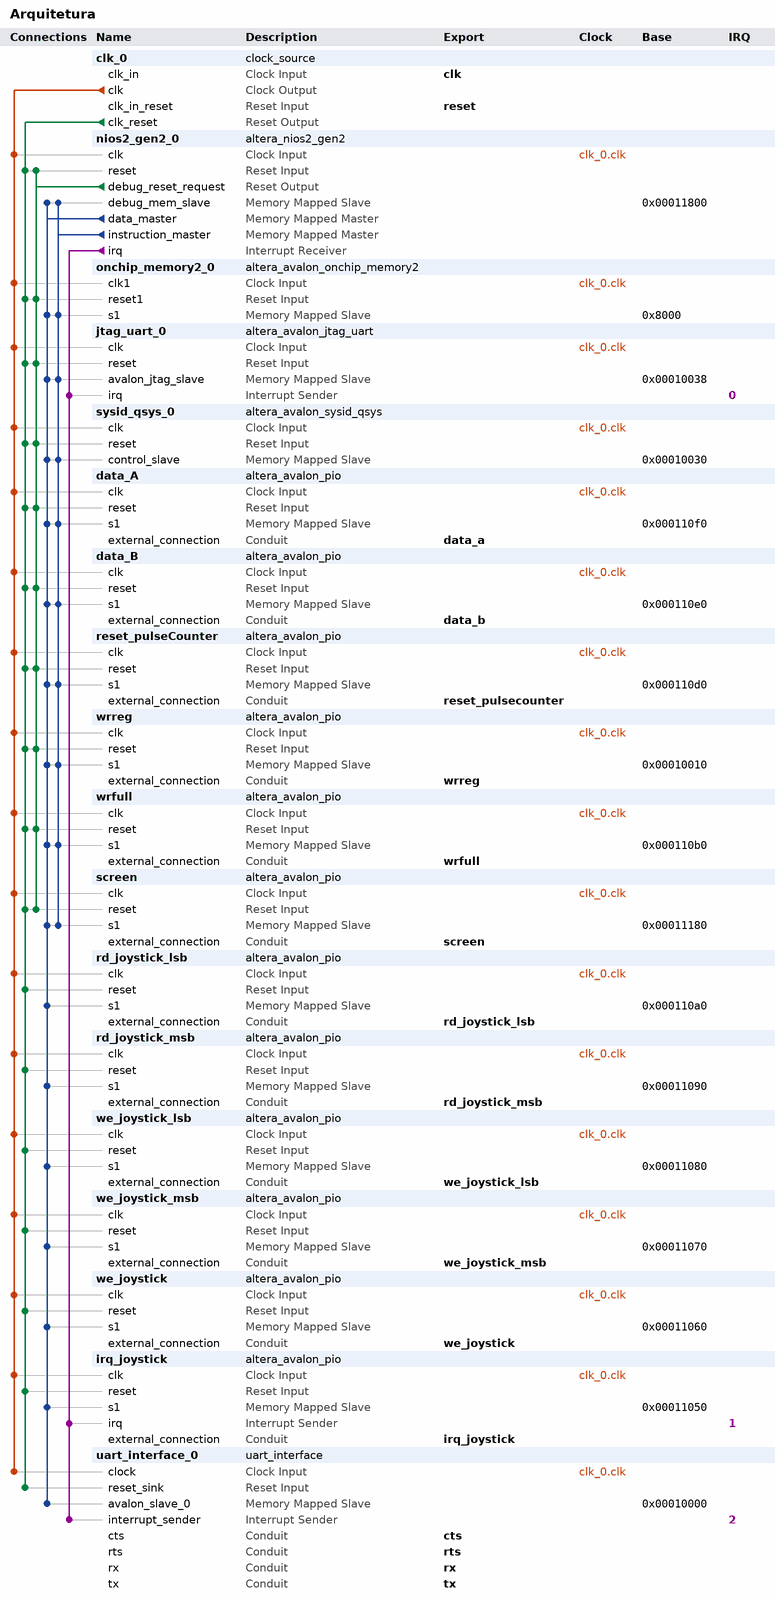
[diagram p0: system contents]
# Platform Designer (Qsys) system Arquitetura, Cyclone IV E EP4CE22F17C6
# Parameters at their usual value, and those the tool derives, are not listed.
package require -exact qsys 23.1
create_system Arquitetura
set_project_property DEVICE_FAMILY {Cyclone IV E}
set_project_property DEVICE EP4CE22F17C6

add_instance clk_0 clock_source 23.1
set_instance_parameter_value clk_0 clockFrequency 50000000

add_instance nios2_gen2_0 altera_nios2_gen2 23.1
set_instance_parameter_value nios2_gen2_0 dcache_size 2048
set_instance_parameter_value nios2_gen2_0 exceptionSlave onchip_memory2_0.s1
set_instance_parameter_value nios2_gen2_0 icache_size 4096
set_instance_parameter_value nios2_gen2_0 impl Tiny
set_instance_parameter_value nios2_gen2_0 resetSlave onchip_memory2_0.s1

add_instance onchip_memory2_0 altera_avalon_onchip_memory2 23.1
set_instance_parameter_value onchip_memory2_0 dataWidth 32
set_instance_parameter_value onchip_memory2_0 dualPort false
set_instance_parameter_value onchip_memory2_0 initMemContent true
set_instance_parameter_value onchip_memory2_0 initializationFileName onchip_mem.hex
set_instance_parameter_value onchip_memory2_0 memorySize 30000

add_instance jtag_uart_0 altera_avalon_jtag_uart 23.1
set_instance_parameter_value jtag_uart_0 simInteractiveOptions NO_INTERACTIVE_WINDOWS

add_instance sysid_qsys_0 altera_avalon_sysid_qsys 23.1
set_instance_parameter_value sysid_qsys_0 id 0

add_instance data_A altera_avalon_pio 23.1
set_instance_parameter_value data_A direction Output
set_instance_parameter_value data_A width 32

add_instance data_B altera_avalon_pio 23.1
set_instance_parameter_value data_B direction Output
set_instance_parameter_value data_B width 32

add_instance reset_pulseCounter altera_avalon_pio 23.1
set_instance_parameter_value reset_pulseCounter direction Output
set_instance_parameter_value reset_pulseCounter width 1

add_instance wrreg altera_avalon_pio 23.1
set_instance_parameter_value wrreg direction Output
set_instance_parameter_value wrreg width 1

add_instance wrfull altera_avalon_pio 23.1
set_instance_parameter_value wrfull direction Input
set_instance_parameter_value wrfull width 1

add_instance screen altera_avalon_pio 23.1
set_instance_parameter_value screen direction Input
set_instance_parameter_value screen width 1

add_instance rd_joystick_lsb altera_avalon_pio 23.1
set_instance_parameter_value rd_joystick_lsb direction Input
set_instance_parameter_value rd_joystick_lsb width 32

add_instance rd_joystick_msb altera_avalon_pio 23.1
set_instance_parameter_value rd_joystick_msb direction Input
set_instance_parameter_value rd_joystick_msb width 32

add_instance we_joystick_lsb altera_avalon_pio 23.1
set_instance_parameter_value we_joystick_lsb direction Output
set_instance_parameter_value we_joystick_lsb width 32

add_instance we_joystick_msb altera_avalon_pio 23.1
set_instance_parameter_value we_joystick_msb direction Output
set_instance_parameter_value we_joystick_msb width 32

add_instance we_joystick altera_avalon_pio 23.1
set_instance_parameter_value we_joystick direction Output
set_instance_parameter_value we_joystick width 1

add_instance irq_joystick altera_avalon_pio 23.1
set_instance_parameter_value irq_joystick direction Input
set_instance_parameter_value irq_joystick generateIRQ true
set_instance_parameter_value irq_joystick width 8

add_instance uart_interface_0 uart_interface 1.0

# connections
add_connection clk_0.clk data_A.clk clock
add_connection clk_0.clk data_B.clk clock
add_connection clk_0.clk irq_joystick.clk clock
add_connection clk_0.clk jtag_uart_0.clk clock
add_connection clk_0.clk nios2_gen2_0.clk clock
add_connection clk_0.clk onchip_memory2_0.clk1 clock
add_connection clk_0.clk rd_joystick_lsb.clk clock
add_connection clk_0.clk rd_joystick_msb.clk clock
add_connection clk_0.clk reset_pulseCounter.clk clock
add_connection clk_0.clk screen.clk clock
add_connection clk_0.clk sysid_qsys_0.clk clock
add_connection clk_0.clk uart_interface_0.clock clock
add_connection clk_0.clk we_joystick.clk clock
add_connection clk_0.clk we_joystick_lsb.clk clock
add_connection clk_0.clk we_joystick_msb.clk clock
add_connection clk_0.clk wrfull.clk clock
add_connection clk_0.clk wrreg.clk clock
add_connection clk_0.clk_reset data_A.reset reset
add_connection clk_0.clk_reset data_B.reset reset
add_connection clk_0.clk_reset irq_joystick.reset reset
add_connection clk_0.clk_reset jtag_uart_0.reset reset
add_connection clk_0.clk_reset nios2_gen2_0.reset reset
add_connection clk_0.clk_reset onchip_memory2_0.reset1 reset
add_connection clk_0.clk_reset rd_joystick_lsb.reset reset
add_connection clk_0.clk_reset rd_joystick_msb.reset reset
add_connection clk_0.clk_reset reset_pulseCounter.reset reset
add_connection clk_0.clk_reset screen.reset reset
add_connection clk_0.clk_reset sysid_qsys_0.reset reset
add_connection clk_0.clk_reset uart_interface_0.reset_sink reset
add_connection clk_0.clk_reset we_joystick.reset reset
add_connection clk_0.clk_reset we_joystick_lsb.reset reset
add_connection clk_0.clk_reset we_joystick_msb.reset reset
add_connection clk_0.clk_reset wrfull.reset reset
add_connection clk_0.clk_reset wrreg.reset reset
add_connection nios2_gen2_0.debug_reset_request data_A.reset reset
add_connection nios2_gen2_0.debug_reset_request data_B.reset reset
add_connection nios2_gen2_0.debug_reset_request jtag_uart_0.reset reset
add_connection nios2_gen2_0.debug_reset_request nios2_gen2_0.reset reset
add_connection nios2_gen2_0.debug_reset_request onchip_memory2_0.reset1 reset
add_connection nios2_gen2_0.debug_reset_request reset_pulseCounter.reset reset
add_connection nios2_gen2_0.debug_reset_request screen.reset reset
add_connection nios2_gen2_0.debug_reset_request sysid_qsys_0.reset reset
add_connection nios2_gen2_0.debug_reset_request wrfull.reset reset
add_connection nios2_gen2_0.debug_reset_request wrreg.reset reset
add_connection nios2_gen2_0.data_master data_A.s1 avalon
set_connection_parameter_value nios2_gen2_0.data_master/data_A.s1 baseAddress 0x000110f0
add_connection nios2_gen2_0.data_master data_B.s1 avalon
set_connection_parameter_value nios2_gen2_0.data_master/data_B.s1 baseAddress 0x000110e0
add_connection nios2_gen2_0.data_master irq_joystick.s1 avalon
set_connection_parameter_value nios2_gen2_0.data_master/irq_joystick.s1 baseAddress 0x00011050
add_connection nios2_gen2_0.data_master jtag_uart_0.avalon_jtag_slave avalon
set_connection_parameter_value nios2_gen2_0.data_master/jtag_uart_0.avalon_jtag_slave baseAddress 0x00010038
add_connection nios2_gen2_0.data_master nios2_gen2_0.debug_mem_slave avalon
set_connection_parameter_value nios2_gen2_0.data_master/nios2_gen2_0.debug_mem_slave baseAddress 0x00011800
add_connection nios2_gen2_0.data_master onchip_memory2_0.s1 avalon
set_connection_parameter_value nios2_gen2_0.data_master/onchip_memory2_0.s1 baseAddress 0x8000
add_connection nios2_gen2_0.data_master rd_joystick_lsb.s1 avalon
set_connection_parameter_value nios2_gen2_0.data_master/rd_joystick_lsb.s1 baseAddress 0x000110a0
add_connection nios2_gen2_0.data_master rd_joystick_msb.s1 avalon
set_connection_parameter_value nios2_gen2_0.data_master/rd_joystick_msb.s1 baseAddress 0x00011090
add_connection nios2_gen2_0.data_master reset_pulseCounter.s1 avalon
set_connection_parameter_value nios2_gen2_0.data_master/reset_pulseCounter.s1 baseAddress 0x000110d0
add_connection nios2_gen2_0.data_master screen.s1 avalon
set_connection_parameter_value nios2_gen2_0.data_master/screen.s1 baseAddress 0x00011180
add_connection nios2_gen2_0.data_master sysid_qsys_0.control_slave avalon
set_connection_parameter_value nios2_gen2_0.data_master/sysid_qsys_0.control_slave baseAddress 0x00010030
add_connection nios2_gen2_0.data_master uart_interface_0.avalon_slave_0 avalon
set_connection_parameter_value nios2_gen2_0.data_master/uart_interface_0.avalon_slave_0 baseAddress 0x00010000
add_connection nios2_gen2_0.data_master we_joystick.s1 avalon
set_connection_parameter_value nios2_gen2_0.data_master/we_joystick.s1 baseAddress 0x00011060
add_connection nios2_gen2_0.data_master we_joystick_lsb.s1 avalon
set_connection_parameter_value nios2_gen2_0.data_master/we_joystick_lsb.s1 baseAddress 0x00011080
add_connection nios2_gen2_0.data_master we_joystick_msb.s1 avalon
set_connection_parameter_value nios2_gen2_0.data_master/we_joystick_msb.s1 baseAddress 0x00011070
add_connection nios2_gen2_0.data_master wrfull.s1 avalon
set_connection_parameter_value nios2_gen2_0.data_master/wrfull.s1 baseAddress 0x000110b0
add_connection nios2_gen2_0.data_master wrreg.s1 avalon
set_connection_parameter_value nios2_gen2_0.data_master/wrreg.s1 baseAddress 0x00010010
add_connection nios2_gen2_0.instruction_master data_A.s1 avalon
set_connection_parameter_value nios2_gen2_0.instruction_master/data_A.s1 baseAddress 0x000110f0
add_connection nios2_gen2_0.instruction_master data_B.s1 avalon
set_connection_parameter_value nios2_gen2_0.instruction_master/data_B.s1 baseAddress 0x000110e0
add_connection nios2_gen2_0.instruction_master jtag_uart_0.avalon_jtag_slave avalon
set_connection_parameter_value nios2_gen2_0.instruction_master/jtag_uart_0.avalon_jtag_slave baseAddress 0x00010038
add_connection nios2_gen2_0.instruction_master nios2_gen2_0.debug_mem_slave avalon
set_connection_parameter_value nios2_gen2_0.instruction_master/nios2_gen2_0.debug_mem_slave baseAddress 0x00011800
add_connection nios2_gen2_0.instruction_master onchip_memory2_0.s1 avalon
set_connection_parameter_value nios2_gen2_0.instruction_master/onchip_memory2_0.s1 baseAddress 0x8000
add_connection nios2_gen2_0.instruction_master reset_pulseCounter.s1 avalon
set_connection_parameter_value nios2_gen2_0.instruction_master/reset_pulseCounter.s1 baseAddress 0x000110d0
add_connection nios2_gen2_0.instruction_master screen.s1 avalon
set_connection_parameter_value nios2_gen2_0.instruction_master/screen.s1 baseAddress 0x00011180
add_connection nios2_gen2_0.instruction_master sysid_qsys_0.control_slave avalon
set_connection_parameter_value nios2_gen2_0.instruction_master/sysid_qsys_0.control_slave baseAddress 0x00010030
add_connection nios2_gen2_0.instruction_master wrfull.s1 avalon
set_connection_parameter_value nios2_gen2_0.instruction_master/wrfull.s1 baseAddress 0x000110b0
add_connection nios2_gen2_0.instruction_master wrreg.s1 avalon
set_connection_parameter_value nios2_gen2_0.instruction_master/wrreg.s1 baseAddress 0x00010010
add_connection nios2_gen2_0.irq irq_joystick.irq interrupt
set_connection_parameter_value nios2_gen2_0.irq/irq_joystick.irq irqNumber 1
add_connection nios2_gen2_0.irq jtag_uart_0.irq interrupt
set_connection_parameter_value nios2_gen2_0.irq/jtag_uart_0.irq irqNumber 0
add_connection nios2_gen2_0.irq uart_interface_0.interrupt_sender interrupt
set_connection_parameter_value nios2_gen2_0.irq/uart_interface_0.interrupt_sender irqNumber 2

# exported interfaces
add_interface clk clock sink
set_interface_property clk EXPORT_OF clk_0.clk_in
add_interface cts conduit end
set_interface_property cts EXPORT_OF uart_interface_0.cts
add_interface data_a conduit end
set_interface_property data_a EXPORT_OF data_A.external_connection
add_interface data_b conduit end
set_interface_property data_b EXPORT_OF data_B.external_connection
add_interface irq_joystick conduit end
set_interface_property irq_joystick EXPORT_OF irq_joystick.external_connection
add_interface rd_joystick_lsb conduit end
set_interface_property rd_joystick_lsb EXPORT_OF rd_joystick_lsb.external_connection
add_interface rd_joystick_msb conduit end
set_interface_property rd_joystick_msb EXPORT_OF rd_joystick_msb.external_connection
add_interface reset reset sink
set_interface_property reset EXPORT_OF clk_0.clk_in_reset
add_interface reset_pulsecounter conduit end
set_interface_property reset_pulsecounter EXPORT_OF reset_pulseCounter.external_connection
add_interface rts conduit end
set_interface_property rts EXPORT_OF uart_interface_0.rts
add_interface rx conduit end
set_interface_property rx EXPORT_OF uart_interface_0.rx
add_interface screen conduit end
set_interface_property screen EXPORT_OF screen.external_connection
add_interface tx conduit end
set_interface_property tx EXPORT_OF uart_interface_0.tx
add_interface we_joystick conduit end
set_interface_property we_joystick EXPORT_OF we_joystick.external_connection
add_interface we_joystick_lsb conduit end
set_interface_property we_joystick_lsb EXPORT_OF we_joystick_lsb.external_connection
add_interface we_joystick_msb conduit end
set_interface_property we_joystick_msb EXPORT_OF we_joystick_msb.external_connection
add_interface wrfull conduit end
set_interface_property wrfull EXPORT_OF wrfull.external_connection
add_interface wrreg conduit end
set_interface_property wrreg EXPORT_OF wrreg.external_connection

set_interconnect_requirement {$system} qsys_mm.clockCrossingAdapter HANDSHAKE
set_interconnect_requirement {$system} qsys_mm.enableEccProtection FALSE
set_interconnect_requirement {$system} qsys_mm.insertDefaultSlave FALSE
set_interconnect_requirement {$system} qsys_mm.maxAdditionalLatency 1

save_system Arquitetura.qsys
